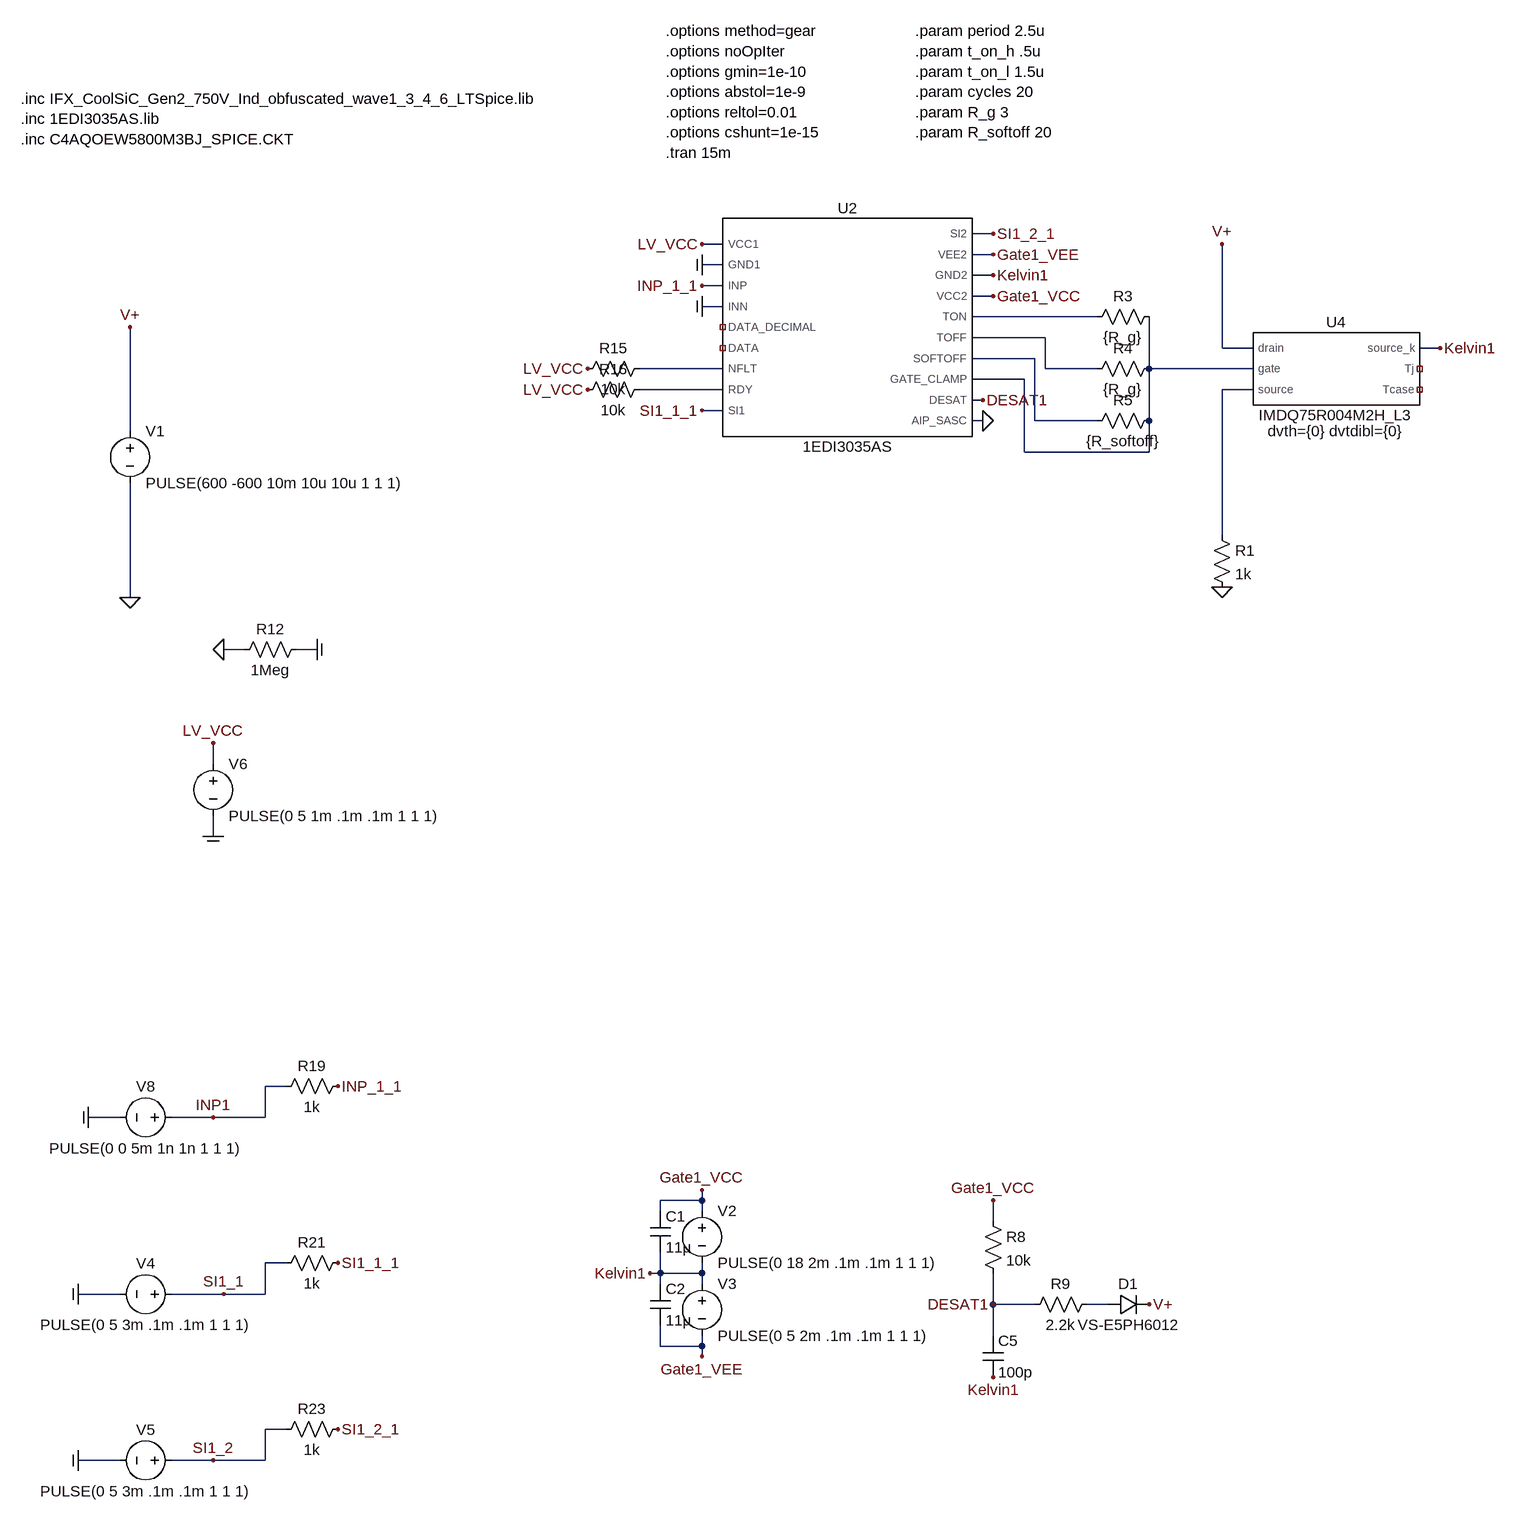
[diagram p0: schematic FET Diode.asc]
FET Diode.asc, the LTspice schematic file:
Version 4.1
SHEET 1 4068 2412
WIRE 496 -48 464 -48
WIRE 80 -32 48 -32
WIRE 496 -16 464 -16
WIRE 80 0 48 0
WIRE 496 16 464 16
WIRE 80 32 48 32
WIRE 496 48 464 48
WIRE 80 64 48 64
WIRE 656 80 464 80
WIRE 576 112 464 112
WIRE 848 128 848 -32
WIRE 896 128 848 128
WIRE 1184 128 1152 128
WIRE 560 144 464 144
WIRE 80 160 -48 160
WIRE 576 160 576 112
WIRE 656 160 576 160
WIRE 736 160 736 80
WIRE 896 160 736 160
WIRE 544 176 464 176
WIRE 80 192 -48 192
WIRE 896 192 848 192
WIRE 480 208 464 208
WIRE 80 224 48 224
WIRE 480 240 464 240
WIRE 560 240 560 144
WIRE 656 240 560 240
WIRE 736 240 736 160
WIRE -832 256 -832 96
WIRE 544 288 544 176
WIRE 736 288 736 240
WIRE 736 288 544 288
WIRE 848 416 848 192
WIRE -832 512 -832 336
WIRE -656 592 -688 592
WIRE -544 592 -576 592
WIRE -704 768 -704 736
WIRE -704 880 -704 848
WIRE -592 1264 -624 1264
WIRE -848 1312 -896 1312
WIRE -704 1312 -768 1312
WIRE -624 1312 -624 1264
WIRE -624 1312 -704 1312
WIRE 48 1440 48 1424
WIRE 48 1440 -16 1440
WIRE -16 1456 -16 1440
WIRE 48 1456 48 1440
WIRE 496 1472 496 1440
WIRE -592 1536 -624 1536
WIRE -16 1552 -16 1520
WIRE -16 1552 -32 1552
WIRE 48 1552 48 1536
WIRE 48 1552 -16 1552
WIRE -16 1568 -16 1552
WIRE 48 1568 48 1552
WIRE -848 1584 -912 1584
WIRE -688 1584 -768 1584
WIRE -624 1584 -624 1536
WIRE -624 1584 -688 1584
WIRE 496 1600 496 1552
WIRE 560 1600 496 1600
WIRE 672 1600 640 1600
WIRE 496 1648 496 1600
WIRE -16 1664 -16 1632
WIRE 48 1664 48 1648
WIRE 48 1664 -16 1664
WIRE 48 1680 48 1664
WIRE -592 1792 -624 1792
WIRE -848 1840 -912 1840
WIRE -704 1840 -768 1840
WIRE -624 1840 -624 1792
WIRE -624 1840 -704 1840
FLAG -832 512 0
FLAG 848 -32 V+
FLAG 48 32 INP_1_1
FLAG 48 224 SI1_1_1
FLAG 496 -48 SI1_2_1
FLAG 1184 128 Kelvin1
FLAG 496 16 Kelvin1
FLAG 496 48 Gate1_VCC
FLAG 496 -16 Gate1_VEE
FLAG -32 1552 Kelvin1
FLAG 48 1424 Gate1_VCC
FLAG 48 1680 Gate1_VEE
FLAG 496 1440 Gate1_VCC
FLAG 496 1712 Kelvin1
FLAG 736 1600 V+
FLAG 480 208 DESAT1
FLAG 496 1600 DESAT1
FLAG 48 0 COM
FLAG -688 592 0
FLAG -544 592 COM
FLAG 48 -32 LV_VCC
FLAG -704 736 LV_VCC
FLAG -704 880 COM
FLAG -128 160 LV_VCC
FLAG -128 192 LV_VCC
FLAG -512 1536 SI1_1_1
FLAG -512 1792 SI1_2_1
FLAG -704 1312 INP1
FLAG -688 1584 SI1_1
FLAG -704 1840 SI1_2
FLAG -832 96 V+
FLAG -912 1584 COM
FLAG -912 1840 COM
FLAG -896 1312 COM
FLAG -512 1264 INP_1_1
FLAG 848 496 0
FLAG 48 64 COM
FLAG 480 240 0
SYMBOL voltage -832 240 R0
WINDOW 123 0 0 Left 0
SYMATTR InstName V1
SYMATTR Value PULSE(600 -600 10m 10u 10u 1 1 1)
SYMATTR SpiceLine Rser=.1 Cpar=1n
SYMBOL voltage 48 1440 R0
WINDOW 123 0 0 Left 0
SYMATTR InstName V2
SYMATTR Value PULSE(0 18 2m .1m .1m 1 1 1)
SYMATTR SpiceLine Rser=.1 Cpar=1n
SYMBOL voltage 48 1552 R0
WINDOW 123 0 0 Left 0
SYMATTR InstName V3
SYMATTR Value PULSE(0 5 2m .1m .1m 1 1 1)
SYMATTR SpiceLine Rser=.1 Cpar=1n
SYMBOL Res 752 64 R90
WINDOW 0 0 56 VBottom 2
WINDOW 3 32 56 VTop 2
SYMATTR InstName R3
SYMATTR Value {R_g}
SYMBOL Res 752 144 R90
WINDOW 0 0 56 VBottom 2
WINDOW 3 32 56 VTop 2
SYMATTR InstName R4
SYMATTR Value {R_g}
SYMBOL Res 752 224 R90
WINDOW 0 0 56 VBottom 2
WINDOW 3 32 56 VTop 2
SYMATTR InstName R5
SYMATTR Value {R_softoff}
SYMBOL cap -32 1456 R0
SYMATTR InstName C1
SYMATTR Value 11µ
SYMATTR SpiceLine Rser=10m
SYMBOL cap -32 1568 R0
SYMATTR InstName C2
SYMATTR Value 11µ
SYMATTR SpiceLine Rser=10m
SYMBOL res 480 1456 R0
SYMATTR InstName R8
SYMATTR Value 10k
SYMBOL res 656 1584 R90
WINDOW 0 0 56 VBottom 2
WINDOW 3 32 56 VTop 2
SYMATTR InstName R9
SYMATTR Value 2.2k
SYMBOL cap 480 1648 R0
SYMATTR InstName C5
SYMATTR Value 100p
SYMATTR SpiceLine Rser=10m
SYMBOL diode 672 1616 R270
WINDOW 0 32 32 VTop 2
WINDOW 3 0 32 VBottom 2
SYMATTR InstName D1
SYMATTR Value VS-E5PH6012
SYMBOL res -560 576 R90
WINDOW 0 0 56 VBottom 2
WINDOW 3 32 56 VTop 2
SYMATTR InstName R12
SYMATTR Value 1Meg
SYMBOL voltage -704 752 R0
WINDOW 123 0 0 Left 0
SYMATTR InstName V6
SYMATTR Value PULSE(0 5 1m .1m .1m 1 1 1)
SYMATTR SpiceLine Rser=.1 Cpar=1n
SYMBOL res -32 144 R90
WINDOW 0 0 56 VBottom 2
WINDOW 3 32 56 VTop 2
SYMATTR InstName R15
SYMATTR Value 10k
SYMBOL res -32 176 R90
WINDOW 0 0 56 VBottom 2
WINDOW 3 32 56 VTop 2
SYMATTR InstName R16
SYMATTR Value 10k
SYMBOL res -496 1248 R90
WINDOW 0 0 56 VBottom 2
WINDOW 3 32 56 VTop 2
SYMATTR InstName R19
SYMATTR Value 1k
SYMBOL res -496 1520 R90
WINDOW 0 0 56 VBottom 2
WINDOW 3 32 56 VTop 2
SYMATTR InstName R21
SYMATTR Value 1k
SYMBOL res -496 1776 R90
WINDOW 0 0 56 VBottom 2
WINDOW 3 32 56 VTop 2
SYMATTR InstName R23
SYMATTR Value 1k
SYMBOL voltage -752 1584 R90
WINDOW 0 -32 56 VBottom 2
WINDOW 3 32 56 VTop 2
WINDOW 123 0 0 Left 0
SYMATTR InstName V4
SYMATTR Value PULSE(0 5 3m .1m .1m 1 1 1)
SYMATTR SpiceLine Rser=.1 Cpar=1n
SYMBOL voltage -752 1840 R90
WINDOW 0 -32 56 VBottom 2
WINDOW 3 32 56 VTop 2
WINDOW 123 0 0 Left 0
SYMATTR InstName V5
SYMATTR Value PULSE(0 5 3m .1m .1m 1 1 1)
SYMATTR SpiceLine Rser=.1 Cpar=1n
SYMBOL voltage -752 1312 R90
WINDOW 0 -32 56 VBottom 2
WINDOW 3 32 56 VTop 2
WINDOW 123 0 0 Left 0
SYMATTR InstName V8
SYMATTR Value PULSE(0 0 5m 1n 1n 1 1 1)
SYMATTR SpiceLine Rser=.1 Cpar=1n
SYMBOL IMDQ75R004M2H_L3 1024 160 R0
SYMATTR InstName U4
SYMBOL 1EDI3035AS 272 96 R0
SYMATTR InstName U2
SYMBOL res 832 400 R0
SYMATTR InstName R1
SYMATTR Value 1k
TEXT -8 -360 Left 2 !.options method=gear\n.options noOpIter\n.options gmin=1e-10\n.options abstol=1e-9\n.options reltol=0.01\n.options cshunt=1e-15\n.tran 15m
TEXT -1000 -256 Left 2 !.inc IFX_CoolSiC_Gen2_750V_Ind_obfuscated_wave1_3_4_6_LTSpice.lib\n.inc 1EDI3035AS.lib\n.inc C4AQOEW5800M3BJ_SPICE.CKT
TEXT 376 -360 Left 2 !.param period 2.5u\n.param t_on_h .5u\n.param t_on_l 1.5u\n.param cycles 20\n.param R_g 3\n.param R_softoff 20

The netlist it stands for:
* FET Diode.asc
V1 V+ 0 PULSE(600 -600 10m 10u 10u 1 1 1) Rser=.1 Cpar=1n
V2 Gate1_VCC Kelvin1 PULSE(0 18 2m .1m .1m 1 1 1) Rser=.1 Cpar=1n
V3 Kelvin1 Gate1_VEE PULSE(0 5 2m .1m .1m 1 1 1) Rser=.1 Cpar=1n
R3 N005 N001 {R_g}
R4 N005 N002 {R_g}
R5 N005 N003 {R_softoff}
C1 Gate1_VCC Kelvin1 11µ Rser=10m
C2 Kelvin1 Gate1_VEE 11µ Rser=10m
R8 Gate1_VCC DESAT1 10k
R9 N008 DESAT1 2.2k
C5 DESAT1 Kelvin1 100p Rser=10m
D1 N008 V+ VS-E5PH6012
R12 COM 0 1Meg
V6 LV_VCC COM PULSE(0 5 1m .1m .1m 1 1 1) Rser=.1 Cpar=1n
R15 N004 LV_VCC 10k
R16 N006 LV_VCC 10k
R19 INP_1_1 INP1 1k
R21 SI1_1_1 SI1_1 1k
R23 SI1_2_1 SI1_2 1k
V4 SI1_1 COM PULSE(0 5 3m .1m .1m 1 1 1) Rser=.1 Cpar=1n
V5 SI1_2 COM PULSE(0 5 3m .1m .1m 1 1 1) Rser=.1 Cpar=1n
V8 INP1 COM PULSE(0 0 5m 1n 1n 1 1 1) Rser=.1 Cpar=1n
X§U4 V+ N005 N007 Kelvin1 NC_01 NC_02 IMDQ75R004M2H_L3 dvth={0} dvtdibl={0}  ; pins drain gate source source_k Tj Tcase
X§U2 LV_VCC COM INP_1_1 COM NC_03 NC_04 N004 N006 SI1_1_1 SI1_2_1 Gate1_VEE Kelvin1 Gate1_VCC N001 N002 N003 N005 DESAT1 0 1EDI3035AS  ; pins VCC1 GND1 INP INN DATA_DECIMAL DATA NFLT RDY SI1 SI2 VEE2 GND2 VCC2 TON TOFF SOFTOFF GATE_CLAMP DESAT AIP_SASC
R1 N007 0 1k
.model D D
.lib standard.dio
.options method=gear
.options noOpIter
.options gmin=1e-10
.options abstol=1e-9
.options reltol=0.01
.options cshunt=1e-15
.tran 15m
.inc IFX_CoolSiC_Gen2_750V_Ind_obfuscated_wave1_3_4_6_LTSpice.lib
.inc 1EDI3035AS.lib
.inc C4AQOEW5800M3BJ_SPICE.CKT
.param period 2.5u
.param t_on_h .5u
.param t_on_l 1.5u
.param cycles 20
.param R_g 3
.param R_softoff 20
.lib /Users/vladroiban/Documents/Inverter/LTSpice/1EDI3035AS.lib
.backanno
.end